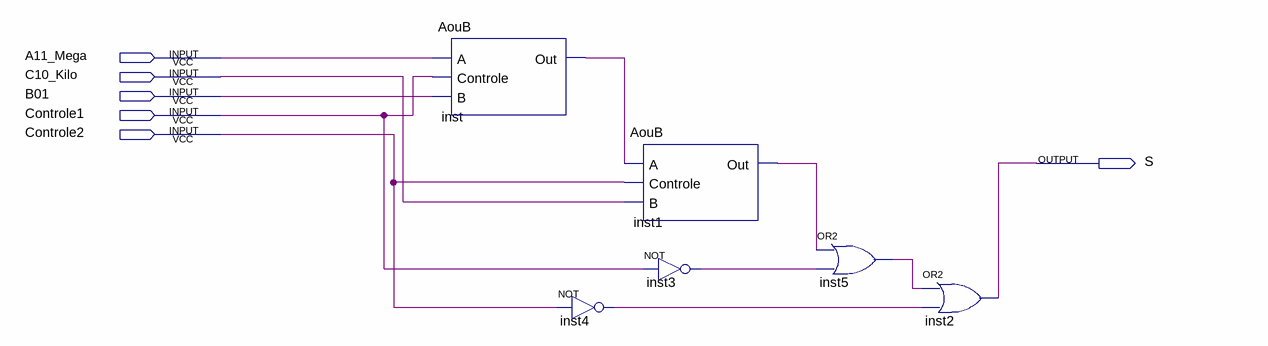
[diagram p0: schematic sheet]
// Quartus schematic Seletor.bdf as structural Verilog: 6 symbols, 6 pins
module Seletor (
  input  A11_Mega,
  input  C10_Kilo,
  input  B01,
  input  Controle1,
  input  Controle2,
  output S
);

  wire inst1_out, inst3_out, inst4_out, inst5_out, inst_out;

  AouB inst (.A(A11_Mega), .Controle(Controle1), .B(B01), .Out(inst_out));
  not inst4 (inst4_out, Controle2);
  AouB inst1 (.A(inst_out), .Controle(Controle2), .B(C10_Kilo), .Out(inst1_out));
  not inst3 (inst3_out, Controle1);
  or inst5 (inst5_out, inst1_out, inst3_out);
  or inst2 (S, inst5_out, inst4_out);
endmodule
